# EasyEDA schematic SCH_nixie clock_2022-01-09.json

## Sheets
1 Sheet_1: TITLE: Sheet_1; REV: 1.0; Date: 2022-01-02; Sheet: 1/1; Drawn By: MilanR; Company: Your Company
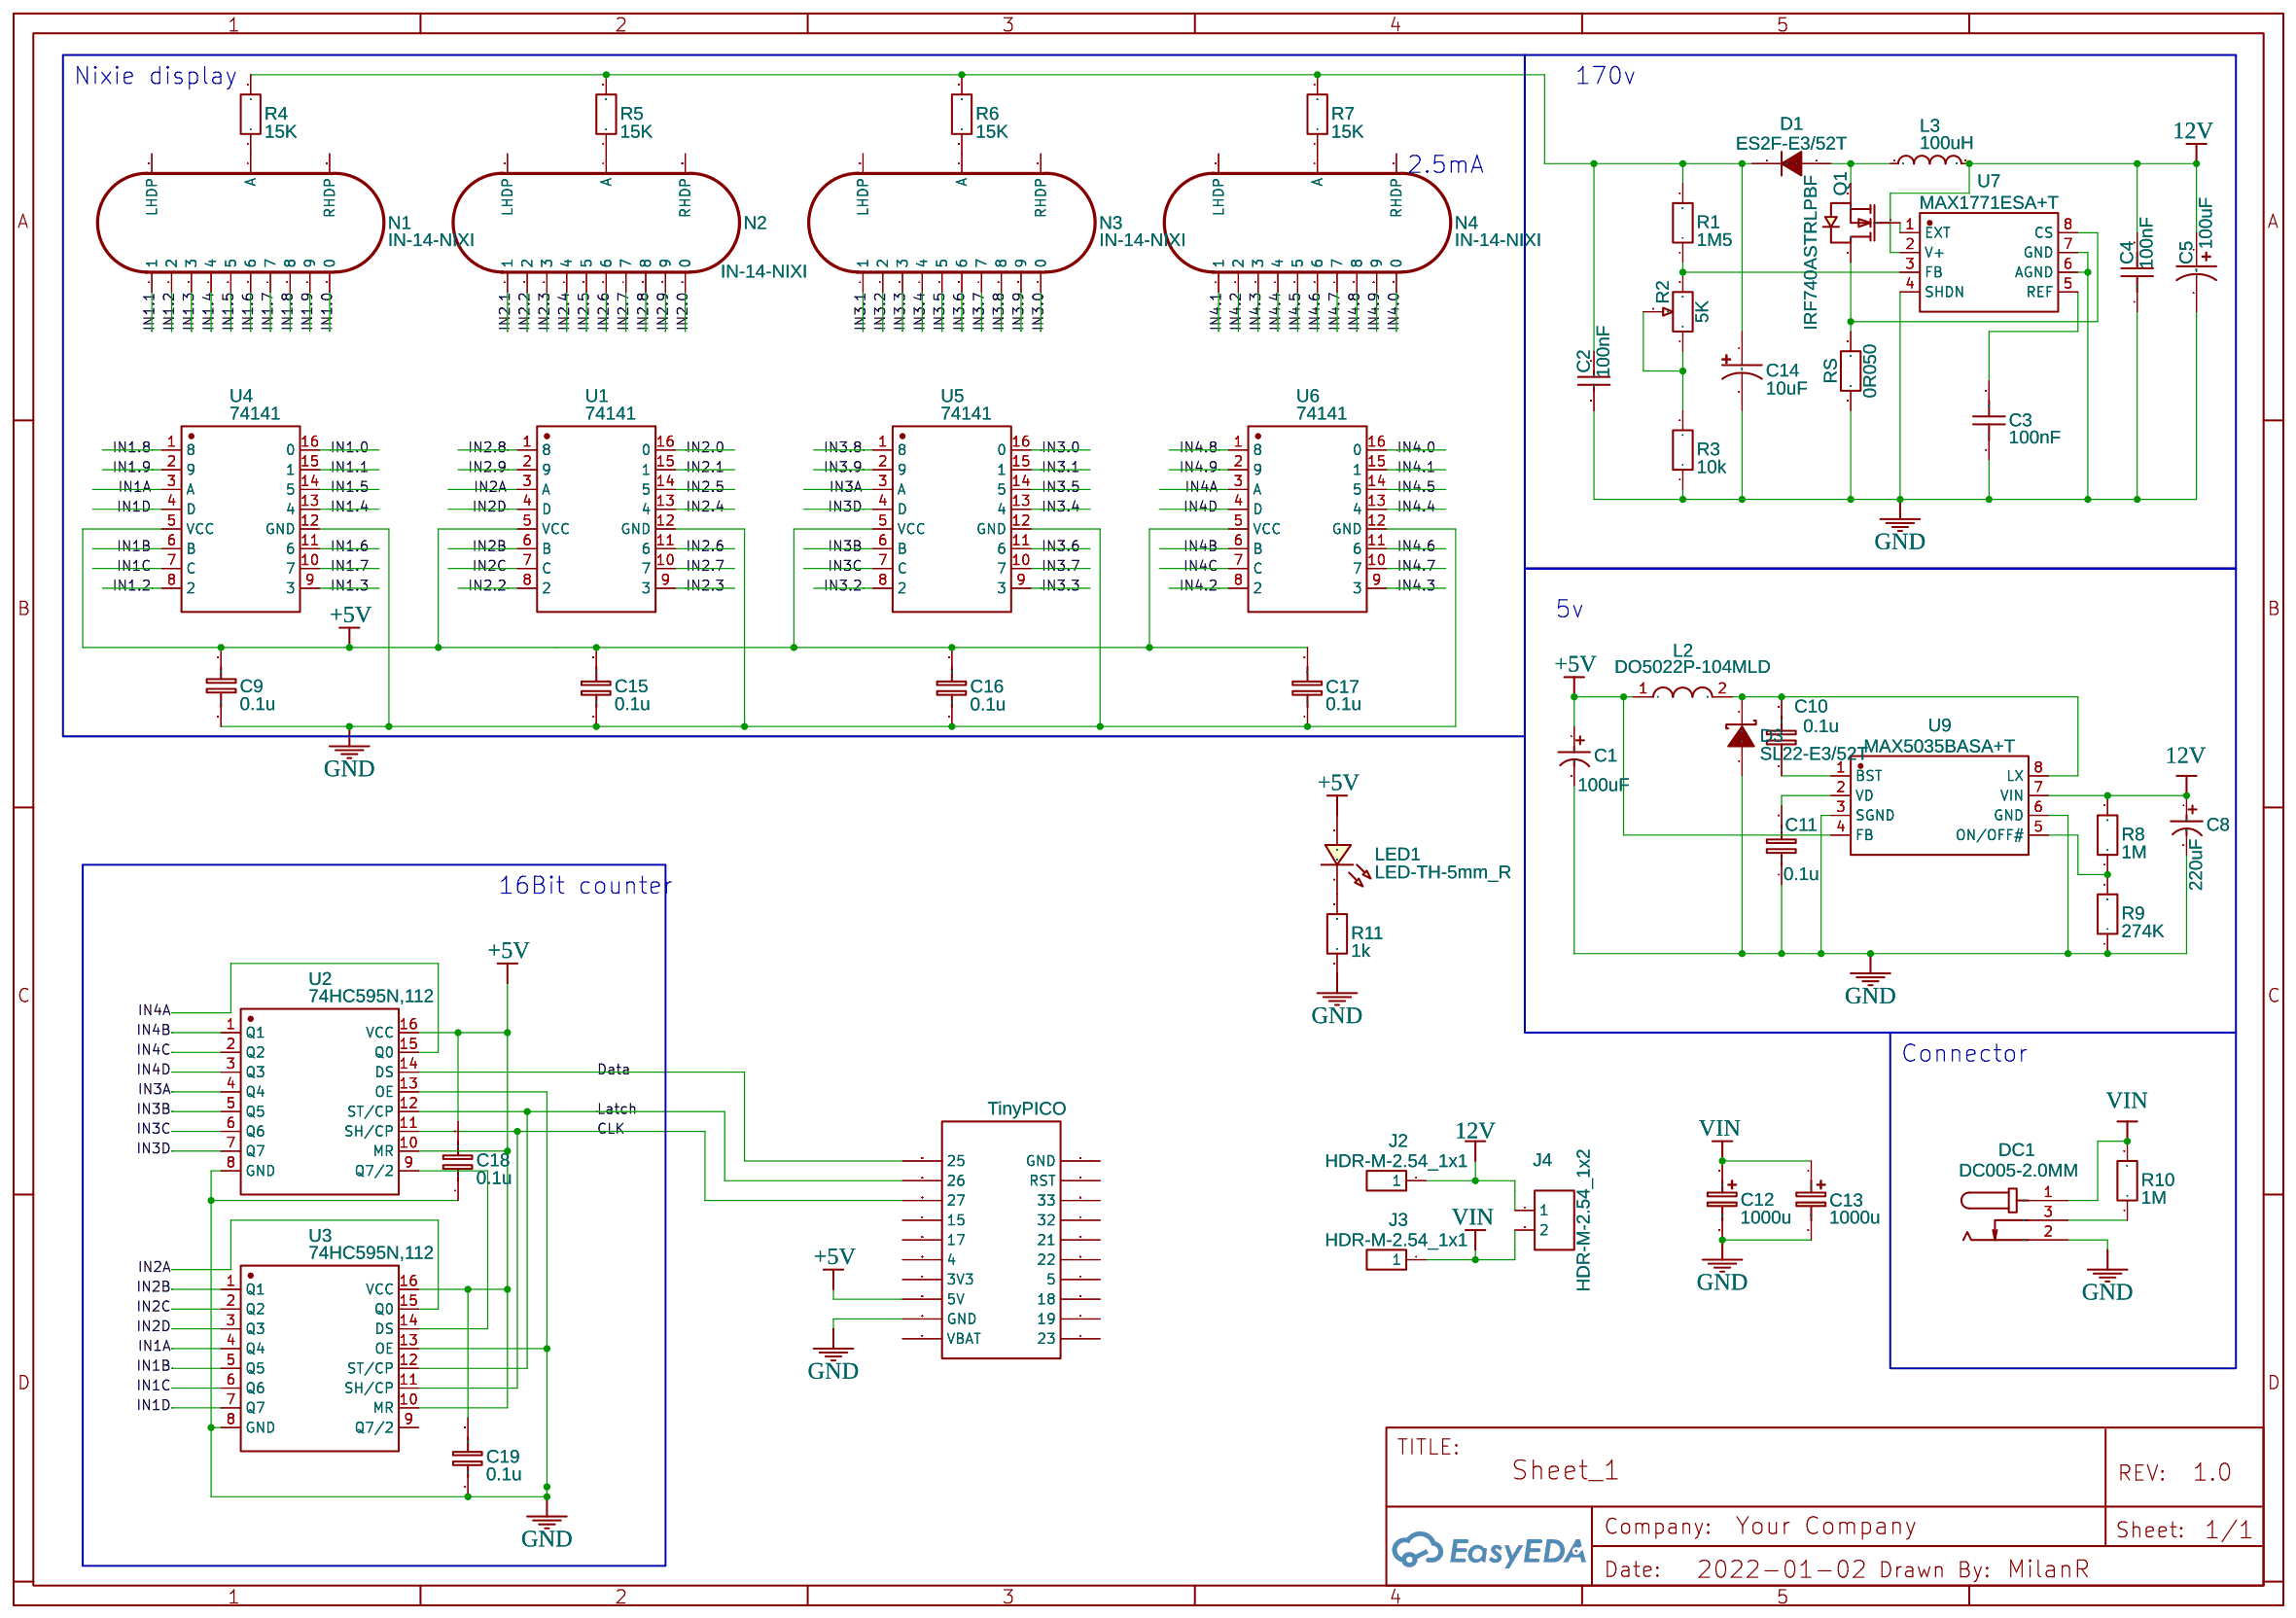
[diagram p0: Sheet_1]
2 Sheet_2: TITLE: Sheet_2; Date: 2022-01-03
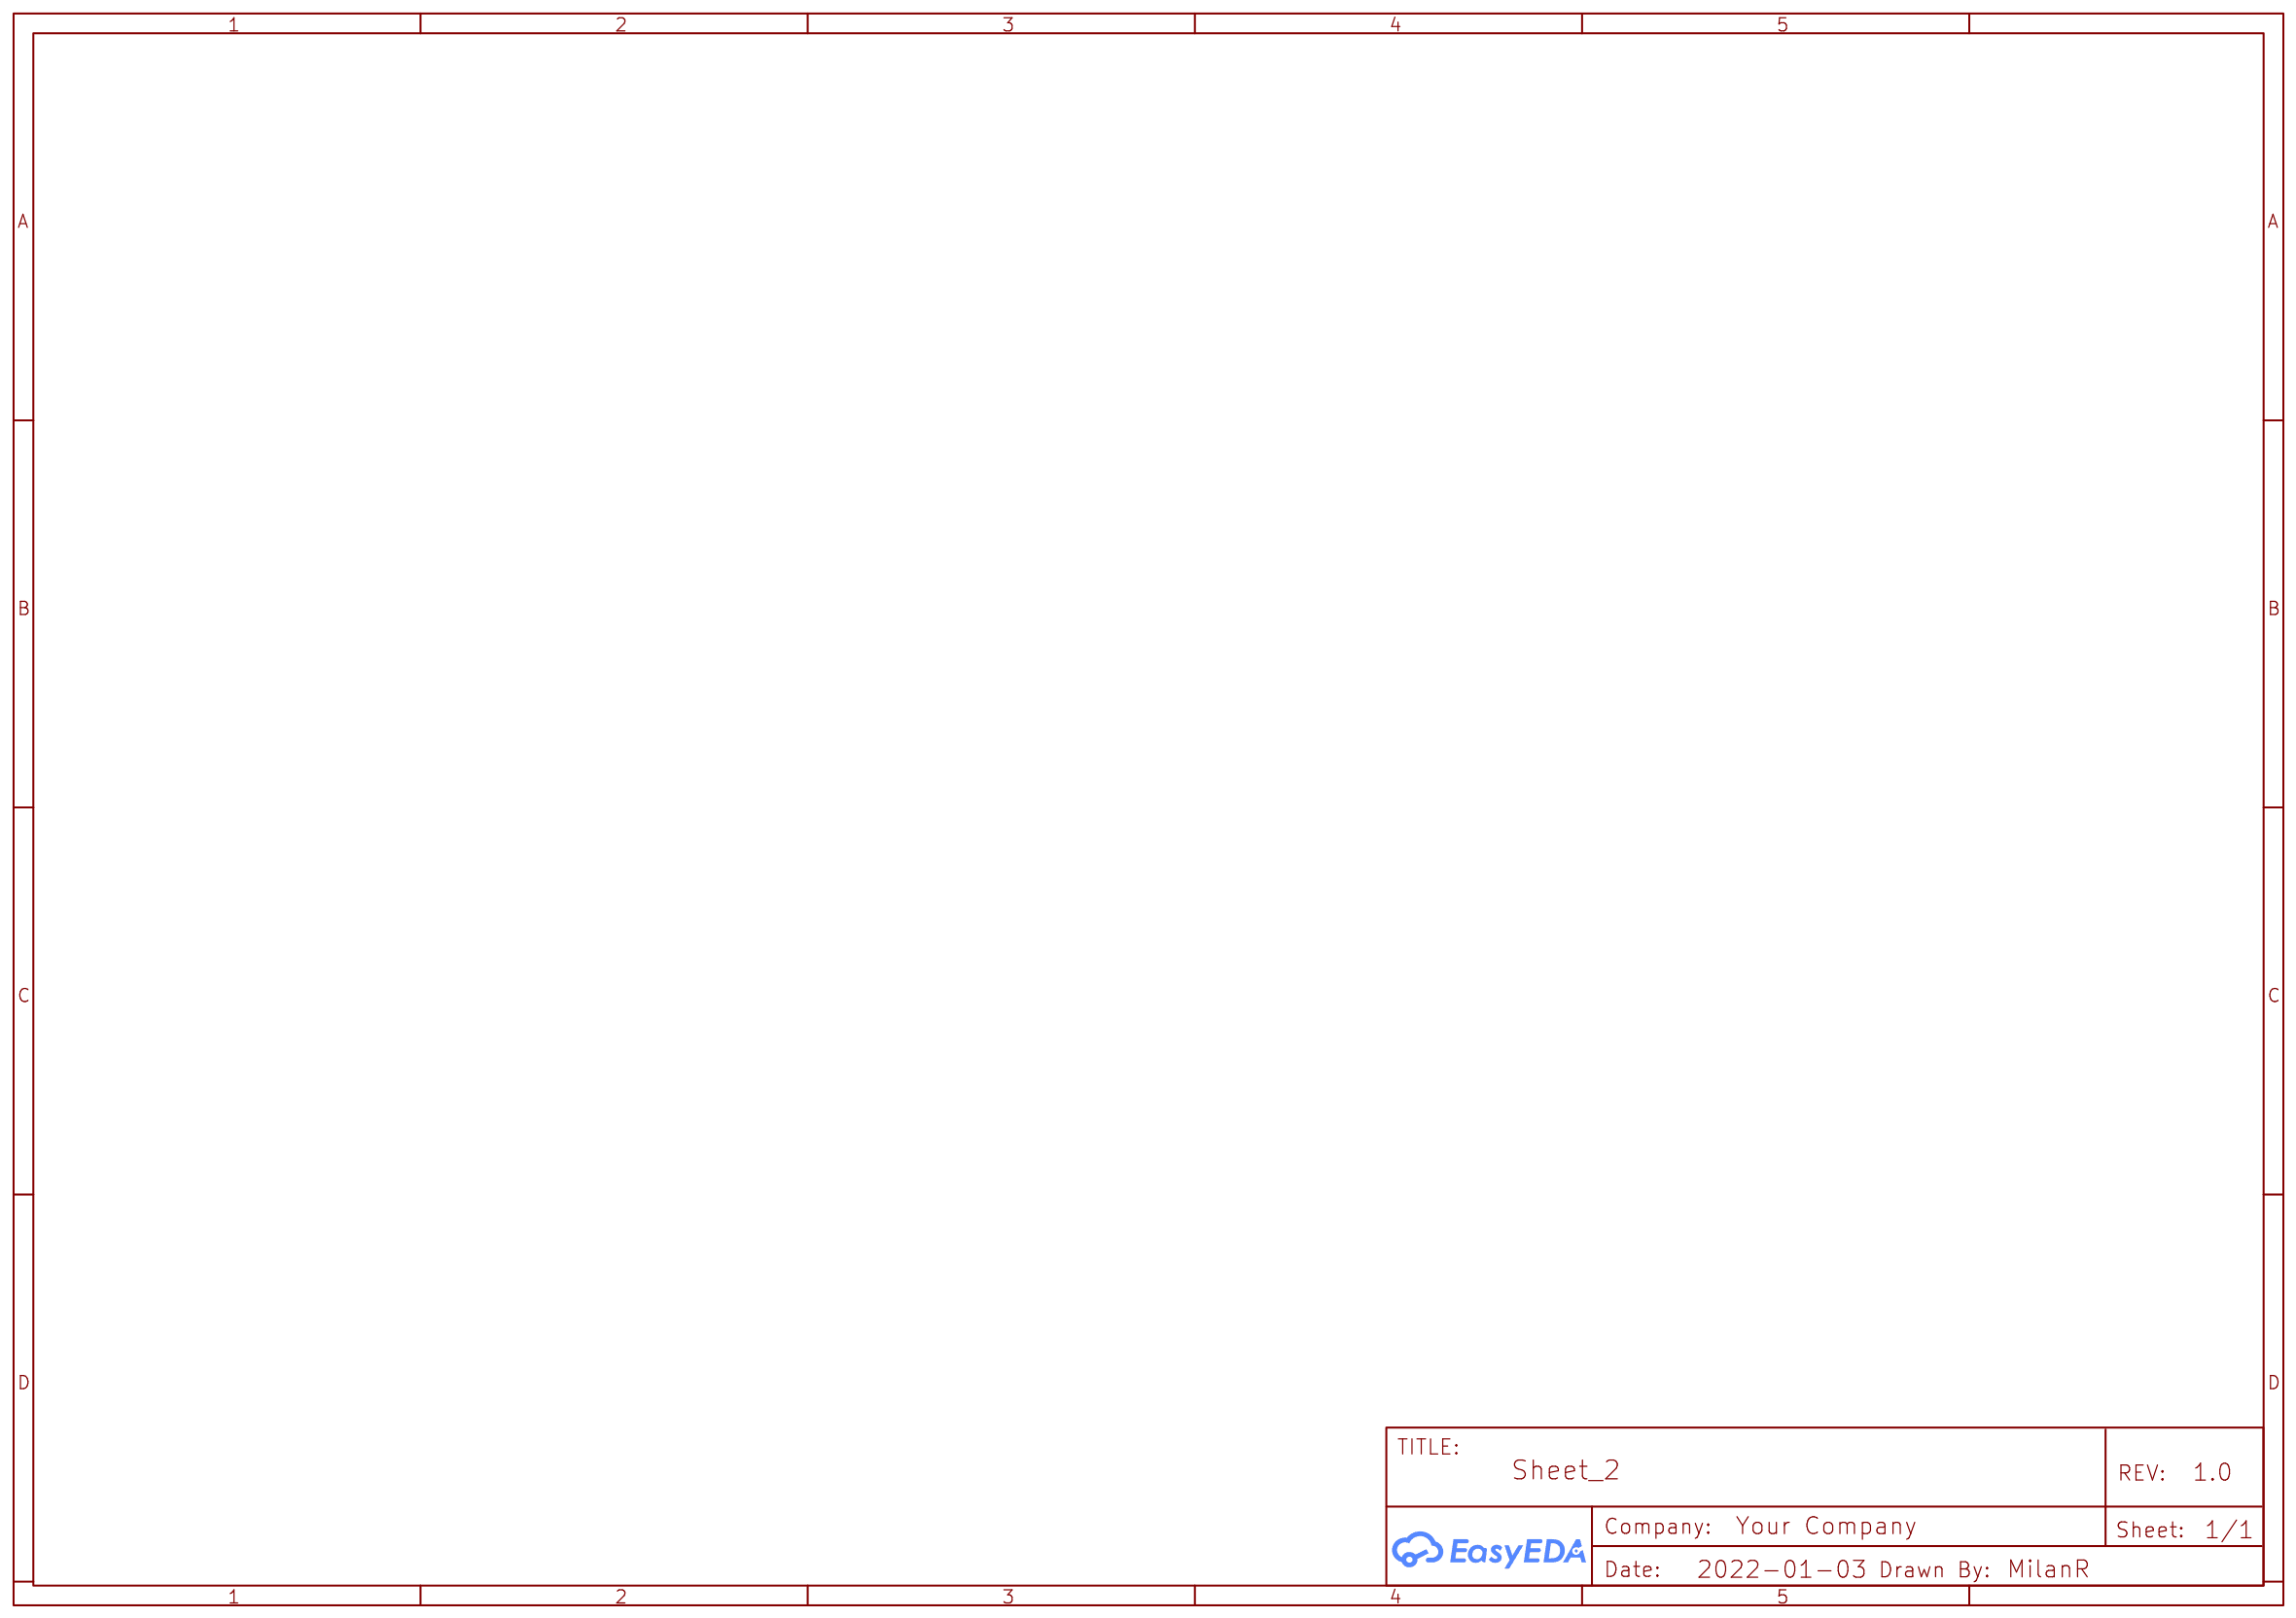
[diagram p1: Sheet_2]

## Parts
C1  100uF  [CAP-TH_BD5.0-P2.00-D0.8-FD]
C2  100nF  [C1210]
C3  100nF  [C0805]
C4  100nF  [C0805]
C5  100uF  [CASE-D_7343]
C8  220uF  [CAP-TH_BD6.3-P2.50-D1.0-FD]
C9  0.1u  [C0805]
C10  0.1u  [C0805]
C11  0.1u  [C0805]
C12  1000u  [CAP-D10.0×F5.0]
C13  1000u  [CAP-D10.0×F5.0]
C14  10uF  [CAP-TH_BD10.0-P5.00-D1.0-FD]
C15  0.1u  [C0805]
C16  0.1u  [C0805]
C17  0.1u  [C0805]
C18  0.1u  [C0805]
C19  0.1u  [C0805]
D1  ES2F-E3/52T  [SMB_L4.6-W3.6-LS5.3-RD]
D3  SL22-E3/52T  [SMB_L4.6-W3.6-LS5.3-RD]
DC1  DC005-2.0MM  [DC-IN-TH_DC005]
J2  HDR-M-2.54_1x1  [HDR-M-2.54_1X1]
J3  HDR-M-2.54_1x1  [HDR-M-2.54_1X1]
J4  HDR-M-2.54_1x2  [HDR-M-2.54_1X2]
L2  DO5022P-104MLD  [DO5022P-104MLD]
L3  100uH  [IHLP6767GZER101M11]
LED1  LED-TH-5mm_R  [LED-TH_BD5.0_RED]
N1  IN-14-NIXI  [IN-14]
N2  IN-14-NIXI  [IN-14]
N3  IN-14-NIXI  [IN-14]
N4  IN-14-NIXI  [IN-14]
NO  TinyPICO  [TINYPICO]
Q1  IRF740ASTRLPBF  [D2PAK_L10.0-W9.0-P2.54-LS15.0-BR]
R1  1M5  [R1206]
R2  5K  [RES-ADJ-TH_3P-L5.0-W4.5-P2.35-BR]
R3  10k  [R1206]
R4  15K  [R_AXIAL-0.3]
R5  15K  [R_AXIAL-0.3]
R6  15K  [R_AXIAL-0.3]
R7  15K  [R_AXIAL-0.3]
R8  1M  [R0805]
R9  274K  [R0805]
R10  1M  [R0805]
R11  1k  [R0805]
RS  0R050  [R0805]
U1  74141  [DIP16]
U2  74HC595N,112  [DIP16]
U3  74HC595N,112  [DIP16]
U4  74141  [DIP16]
U5  74141  [DIP16]
U6  74141  [DIP16]
U7  MAX1771ESA+T  [SO-8_L4.9-W3.9-P1.27-LS6.0-BL]
U9  MAX5035BASA+T  [SOIC-8_L4.9-W3.9-P1.27-LS6.0-BL]

## Library data of the parts
C1 = 25YXJ100M5X11: Supplier: LCSC; Manufacturer: Rubycon; Supplier Part: C108360; JLCPCB Part Class: Extended Part
C2 = C3225X7R2E104KT020U: Supplier: LCSC; Manufacturer: TDK; Supplier Part: C76688
C3 C4 = 0805B104J500: Supplier: LCSC; Supplier Part: C116832; Manufacturer: Huaxin S&T; Contributor: LCSC
C5 = TPSD107K020R0100: Supplier: LCSC; Supplier Part: C444810; Manufacturer: AVX; Contributor: LCSC
C8 = 25YXJ220M6.3X11: Supplier: LCSC; Manufacturer: Rubycon; Supplier Part: C88729; JLCPCB Part Class: Extended Part
C9-C11 C15-C19 = C_0805_EU: Contributor: LCEDA_Lib
C12 C13 = CE_TH_D10.0×F5.0_EU: Contributor: LCEDA_Lib
C14 = ECA2EHG100: Supplier: LCSC; Supplier Part: C178409; Manufacturer: PANASONIC; Contributor: LCSC; JLCPCB Part Class: Extended Part
D1 = ES2F-E3/52T: Supplier: LCSC; Manufacturer: VISHAY; Contributor: LCSC; Supplier Part: C145321; JLCPCB Part Class: Extended Part
D3 = SL22-E3/52T: Supplier: LCSC; Manufacturer: VISHAY; Contributor: LCSC; Supplier Part: C142616; JLCPCB Part Class: Extended Part
DC1 = DC005-2.0MM: Supplier: LCSC; Manufacturer: SOFNG; Supplier Part: C111567
J2 J3 = HDR-M-2.54_1x1: Supplier Part: C81276; Supplier: LCSC; Contributor: LCEDA_Lib
J4 = HDR-M-2.54_1x2: Supplier Part: C124375; Supplier: LCSC; Contributor: LCEDA_Lib
L2 = DO5022P-104MLD: Contributor: Menguy
L3 = IHLP6767GZER101M11: Supplier: Digi-Key; Supplier Part: 541-1294-1-ND; Manufacturer: Vishay Dale; Contributor: linebox
LED1 = LED-TH-5mm_R: Manufacturer: EVERLIGHT(台湾亿光); Manufacturer Part: 333-2SURD/S530-A3; Supplier Part: C87271; Supplier: LCSC; Contributor: LCEDA_Lib
N1-N4 = IN-14-NIXI: Contributor: bl4ck_dog
NO = TinyPICO: Manufacturer: Unexpected Maker; Supplier: Unexpected Maker; Contributor: ecenuig
Q1 = IRF740ASTRLPBF: Supplier: LCSC; Supplier Part: C467558; Manufacturer: Vishay Intertech; Contributor: LCSC; JLCPCB Part Class: Extended Part
R1 R3 = R_1206_EU: Contributor: LCEDA_Lib
R2 = ST-4EA 5K ohm (502): Supplier: LCSC; Supplier Part: C132878; Manufacturer: Nidec Copal Elec; Contributor: LCSC; JLCPCB Part Class: Extended Part
R4-R7 = R_AXIAL-0.3_EU: Contributor: LCEDA_Lib
R8-R11 RS = R_0805_EU: Contributor: LCEDA_Lib
U1 U4-U6 = 74141
U2 U3 = 74HC595N,112
U7 = MAX1771ESA+T: Supplier: LCSC; Supplier Part: C407903; Manufacturer: Maxim Integrated; Contributor: LCSC; JLCPCB Part Class: Extended Part
U9 = MAX5035BASA+T: Supplier: LCSC; Manufacturer: MAXIM; Supplier Part: C39144; JLCPCB Part Class: Extended Part

## Nets
12V: C4.2 C5.1 C8.1 J2.1 J4.1 L3.2 R8.2 U7.2(V+) U9.7(VIN)
+5V: C1.1 C9.1 C15.2 C16.2 C17.2 C18.2 C19.2 L2.1 LED1.1 NO.13(5V) U1.5(VCC) U2.10(MR) U2.16(VCC) U3.10(MR) U3.16(VCC) U4.5(VCC) U5.5(VCC) U6.5(VCC) U9.4(FB)
GND: C1.2 C2.1 C3.1 C4.1 C5.2 C8.2 C9.2 C11.1 C12.2 C13.2 C14.2 C15.1 C16.1 C17.1 C18.1 C19.1 D3.2(A) DC1.2 NO.12(GND) R3.1 R9.1 R11.1 RS.1 U1.12(GND) U2.8(GND) U2.13(OE) U3.8(GND) U3.13(OE) U4.12(GND) U5.12(GND) U6.12(GND) U7.4(SHDN) U7.6(AGND) U7.7(GND) U9.3(SGND) U9.6(GND)
VIN: C12.1 C13.1 DC1.1 J3.1 J4.2 R10.2
CLK: NO.18(27) U2.11(SH/CP) U3.11(SH/CP)
Data: NO.20(25) U2.14(DS)
IN1.0: N1.0 U4.16(0)
IN1.1: N1.1 U4.15(1)
IN1.2: N1.2 U4.8(2)
IN1.3: N1.3 U4.9(3)
IN1.4: N1.4 U4.13(4)
IN1.5: N1.5 U4.14(5)
IN1.6: N1.6 U4.11(6)
IN1.7: N1.7 U4.10(7)
IN1.8: N1.8 U4.1(8)
IN1.9: N1.9 U4.2(9)
IN1A: U3.4(Q4) U4.3(A)
IN1B: U3.5(Q5) U4.6(B)
IN1C: U3.6(Q6) U4.7(C)
IN1D: U3.7(Q7) U4.4(D)
IN2.0: N2.0 U1.16(0)
IN2.1: N2.1 U1.15(1)
IN2.2: N2.2 U1.8(2)
IN2.3: N2.3 U1.9(3)
IN2.4: N2.4 U1.13(4)
IN2.5: N2.5 U1.14(5)
IN2.6: N2.6 U1.11(6)
IN2.7: N2.7 U1.10(7)
IN2.8: N2.8 U1.1(8)
IN2.9: N2.9 U1.2(9)
IN2A: U1.3(A) U3.15(Q0)
IN2B: U1.6(B) U3.1(Q1)
IN2C: U1.7(C) U3.2(Q2)
IN2D: U1.4(D) U3.3(Q3)
IN3.0: N3.0 U5.16(0)
IN3.1: N3.1 U5.15(1)
IN3.2: N3.2 U5.8(2)
IN3.3: N3.3 U5.9(3)
IN3.4: N3.4 U5.13(4)
IN3.5: N3.5 U5.14(5)
IN3.6: N3.6 U5.11(6)
IN3.7: N3.7 U5.10(7)
IN3.8: N3.8 U5.1(8)
IN3.9: N3.9 U5.2(9)
IN3A: U2.4(Q4) U5.3(A)
IN3B: U2.5(Q5) U5.6(B)
IN3C: U2.6(Q6) U5.7(C)
IN3D: U2.7(Q7) U5.4(D)
IN4.0: N4.0 U6.16(0)
IN4.1: N4.1 U6.15(1)
IN4.2: N4.2 U6.8(2)
IN4.3: N4.3 U6.9(3)
IN4.4: N4.4 U6.13(4)
IN4.5: N4.5 U6.14(5)
IN4.6: N4.6 U6.11(6)
IN4.7: N4.7 U6.10(7)
IN4.8: N4.8 U6.1(8)
IN4.9: N4.9 U6.2(9)
IN4A: U2.15(Q0) U6.3(A)
IN4B: U2.1(Q1) U6.6(B)
IN4C: U2.2(Q2) U6.7(C)
IN4D: U2.3(Q3) U6.4(D)
Latch: NO.19(26) U2.12(ST/CP) U3.12(ST/CP)
Net-(C2-2): C2.2 C14.1 D1.1(K) R1.2 R4.2 R5.2 R6.2 R7.2
Net-(C3-2): C3.2 U7.5(REF)
Net-(C10-1): C10.1 U9.1(BST)
Net-(C10-2): C10.2 D3.1(K) L2.2 U9.8(LX)
Net-(C11-2): C11.2 U9.2(VD)
Net-(D1-2): D1.2(A) L3.1 Q1.3(S)
Net-(DC1-3): DC1.3 R10.1
Net-(LED1-2): LED1.2 R11.2
Net-(N1-A): N1.A R4.1
Net-(N2-A): N2.A R5.1
Net-(N3-A): N3.A R6.1
Net-(N4-A): N4.A R7.1
Net-(Q1-1): Q1.1(G) U7.1(EXT)
Net-(Q1-2): Q1.2(D) RS.2 U7.8(CS)
Net-(R1-1): R1.1 R2.3 U7.3(FB)
Net-(R2-1): R2.1 R2.2 R3.2
Net-(R8-1): R8.1 R9.2 U9.5(ON/OFF#)
Net-(U2-9): U2.9(Q7/2) U3.14(DS)

Not connected (* = marked no-connect by the designer): N1 LHDP RHDP; N2 LHDP RHDP; N3 LHDP RHDP; N4 LHDP RHDP; NO 1(23) 2(19) 3(18) 4(5) 5(22) 6(21) 7(32) 8(33) 9(RST) 10(GND) 11(VBAT) 14(3V3) 15(4) 16(17) 17(15); U3 9(Q7/2)

## Notes on the sheets
sheet 1
- Nixie display
- 170v
- 2.5mA
- 5v
- 16Bit counter
- Connector
